# Altium schematic sheet Sheet1.SchDoc
size A
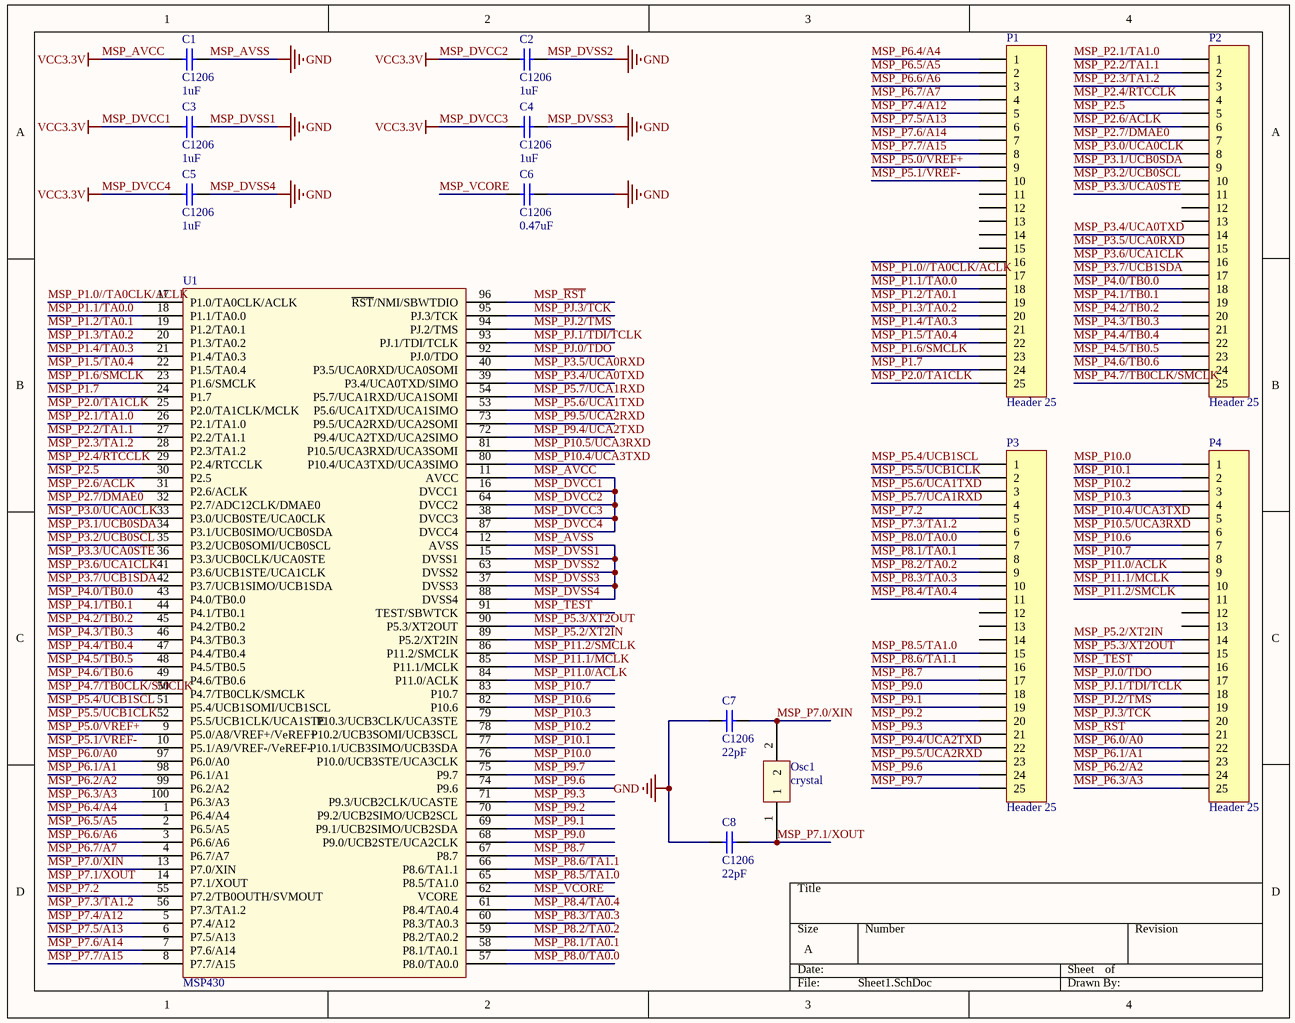
[diagram p0: Sheet1.SchDoc]

## Parts
C1  C1206  value 1uF  [1206]
C2  C1206  value 1uF  [1206]
C3  C1206  value 1uF  [1206]
C4  C1206  value 1uF  [1206]
C5  C1206  value 1uF  [1206]
C6  C1206  value 0.47uF  [1206]
C7  C1206  value 22pF  [1206]
C8  C1206  value 22pF  [1206]
Osc1  crystal  [PCBComponent_1]
P1  Header 25  [HDR1X25]
P2  Header 25  [HDR1X25]
P3  Header 25  [HDR1X25]
P4  Header 25  [HDR1X25]
U1  MSP430  [TSQFP50P1600X1600X160-100N]

## Nets
MSP_AVCC: C1.1 C2.1 C3.1 C4.1 C5.1 U1.11(AVCC) U1.16(DVCC1) U1.38(DVCC3) U1.64(DVCC2) U1.87(DVCC4)  [also labelled MSP_DVCC1, MSP_DVCC2, MSP_DVCC3, MSP_DVCC4, VCC3.3V]
MSP_AVSS: C1.2 C2.2 C3.2 C4.2 C5.2 C6.2 C7.1 C8.1 U1.12(AVSS) U1.15(DVSS1) U1.37(DVSS3) U1.63(DVSS2) U1.88(DVSS4)  [also labelled GND, MSP_DVSS1, MSP_DVSS2, MSP_DVSS3, MSP_DVSS4]
MSP_P1.0//TA0CLK/ACLK: P1.17 U1.17(P1.0/TA0CLK/ACLK)
MSP_P1.1/TA0.0: P1.18 U1.18(P1.1/TA0.0)
MSP_P1.2/TA0.1: P1.19 U1.19(P1.2/TA0.1)
MSP_P1.3/TA0.2: P1.20 U1.20(P1.3/TA0.2)
MSP_P1.4/TA0.3: P1.21 U1.21(P1.4/TA0.3)
MSP_P1.5/TA0.4: P1.22 U1.22(P1.5/TA0.4)
MSP_P1.6/SMCLK: P1.23 U1.23(P1.6/SMCLK)
MSP_P1.7: P1.24 U1.24(P1.7)
MSP_P2.0/TA1CLK: P1.25 U1.25(P2.0/TA1CLK/MCLK)
MSP_P2.1/TA1.0: P2.1 U1.26(P2.1/TA1.0)
MSP_P2.2/TA1.1: P2.2 U1.27(P2.2/TA1.1)
MSP_P2.3/TA1.2: P2.3 U1.28(P2.3/TA1.2)
MSP_P2.4/RTCCLK: P2.4 U1.29(P2.4/RTCCLK)
MSP_P2.5: P2.5 U1.30(P2.5)
MSP_P2.6/ACLK: P2.6 U1.31(P2.6/ACLK)
MSP_P2.7/DMAE0: P2.7 U1.32(P2.7/ADC12CLK/DMAE0)
MSP_P3.0/UCA0CLK: P2.8 U1.33(P3.0/UCB0STE/UCA0CLK)
MSP_P3.1/UCB0SDA: P2.9 U1.34(P3.1/UCB0SIMO/UCB0SDA)
MSP_P3.2/UCB0SCL: P2.10 U1.35(P3.2/UCB0SOMI/UCB0SCL)
MSP_P3.3/UCA0STE: P2.11 U1.36(P3.3/UCB0CLK/UCA0STE)
MSP_P3.4/UCA0TXD: P2.14 U1.39(P3.4/UCA0TXD/SIMO)
MSP_P3.5/UCA0RXD: P2.15 U1.40(P3.5/UCA0RXD/UCA0SOMI)
MSP_P3.6/UCA1CLK: P2.16 U1.41(P3.6/UCB1STE/UCA1CLK)
MSP_P3.7/UCB1SDA: P2.17 U1.42(P3.7/UCB1SIMO/UCB1SDA)
MSP_P4.0/TB0.0: P2.18 U1.43(P4.0/TB0.0)
MSP_P4.1/TB0.1: P2.19 U1.44(P4.1/TB0.1)
MSP_P4.2/TB0.2: P2.20 U1.45(P4.2/TB0.2)
MSP_P4.3/TB0.3: P2.21 U1.46(P4.3/TB0.3)
MSP_P4.4/TB0.4: P2.22 U1.47(P4.4/TB0.4)
MSP_P4.5/TB0.5: P2.23 U1.48(P4.5/TB0.5)
MSP_P4.6/TB0.6: P2.24 U1.49(P4.6/TB0.6)
MSP_P4.7/TB0CLK/SMCLK: P2.25 U1.50(P4.7/TB0CLK/SMCLK)
MSP_P5.0/VREF+: P1.9 U1.9(P5.0/A8/VREF+/VeREF+)
MSP_P5.1/VREF-: P1.10 U1.10(P5.1/A9/VREF-/VeREF-)
MSP_P5.2/XT2IN: P4.14 U1.89(P5.2/XT2IN)
MSP_P5.3/XT2OUT: P4.15 U1.90(P5.3/XT2OUT)
MSP_P5.4/UCB1SCL: P3.1 U1.51(P5.4/UCB1SOMI/UCB1SCL)
MSP_P5.5/UCB1CLK: P3.2 U1.52(P5.5/UCB1CLK/UCA1STE)
MSP_P5.6/UCA1TXD: P3.3 U1.53(P5.6/UCA1TXD/UCA1SIMO)
MSP_P5.7/UCA1RXD: P3.4 U1.54(P5.7/UCA1RXD/UCA1SOMI)
MSP_P6.0/A0: P4.22 U1.97(P6.0/A0)
MSP_P6.1/A1: P4.23 U1.98(P6.1/A1)
MSP_P6.2/A2: P4.24 U1.99(P6.2/A2)
MSP_P6.3/A3: P4.25 U1.100(P6.3/A3)
MSP_P6.4/A4: P1.1 U1.1(P6.4/A4)
MSP_P6.5/A5: P1.2 U1.2(P6.5/A5)
MSP_P6.6/A6: P1.3 U1.3(P6.6/A6)
MSP_P6.7/A7: P1.4 U1.4(P6.7/A7)
MSP_P7.0/XIN: C7.2 Osc1.2 U1.13(P7.0/XIN)
MSP_P7.1/XOUT: C8.2 Osc1.1 U1.14(P7.1/XOUT)
MSP_P7.2: P3.5 U1.55(P7.2/TB0OUTH/SVMOUT)
MSP_P7.3/TA1.2: P3.6 U1.56(P7.3/TA1.2)
MSP_P7.4/A12: P1.5 U1.5(P7.4/A12)
MSP_P7.5/A13: P1.6 U1.6(P7.5/A13)
MSP_P7.6/A14: P1.7 U1.7(P7.6/A14)
MSP_P7.7/A15: P1.8 U1.8(P7.7/A15)
MSP_P8.0/TA0.0: P3.7 U1.57(P8.0/TA0.0)
MSP_P8.1/TA0.1: P3.8 U1.58(P8.1/TA0.1)
MSP_P8.2/TA0.2: P3.9 U1.59(P8.2/TA0.2)
MSP_P8.3/TA0.3: P3.10 U1.60(P8.3/TA0.3)
MSP_P8.4/TA0.4: P3.11 U1.61(P8.4/TA0.4)
MSP_P8.5/TA1.0: P3.15 U1.65(P8.5/TA1.0)
MSP_P8.6/TA1.1: P3.16 U1.66(P8.6/TA1.1)
MSP_P8.7: P3.17 U1.67(P8.7)
MSP_P9.0: P3.18 U1.68(P9.0/UCB2STE/UCA2CLK)
MSP_P9.1: P3.19 U1.69(P9.1/UCB2SIMO/UCB2SDA)
MSP_P9.2: P3.20 U1.70(P9.2/UCB2SIMO/UCB2SCL)
MSP_P9.3: P3.21 U1.71(P9.3/UCB2CLK/UCASTE)
MSP_P9.4/UCA2TXD: P3.22 U1.72(P9.4/UCA2TXD/UCA2SIMO)
MSP_P9.5/UCA2RXD: P3.23 U1.73(P9.5/UCA2RXD/UCA2SOMI)
MSP_P9.6: P3.24 U1.74(P9.6)
MSP_P9.7: P3.25 U1.75(P9.7)
MSP_P10.0: P4.1 U1.76(P10.0/UCB3STE/UCA3CLK)
MSP_P10.1: P4.2 U1.77(P10.1/UCB3SIMO/UCB3SDA)
MSP_P10.2: P4.3 U1.78(P10.2/UCB3SOMI/UCB3SCL)
MSP_P10.3: P4.4 U1.79(P10.3/UCB3CLK/UCA3STE)
MSP_P10.4/UCA3TXD: P4.5 U1.80(P10.4/UCA3TXD/UCA3SIMO)
MSP_P10.5/UCA3RXD: P4.6 U1.81(P10.5/UCA3RXD/UCA3SOMI)
MSP_P10.6: P4.7 U1.82(P10.6)
MSP_P10.7: P4.8 U1.83(P10.7)
MSP_P11.0/ACLK: P4.9 U1.84(P11.0/ACLK)
MSP_P11.1/MCLK: P4.10 U1.85(P11.1/MCLK)
MSP_P11.2/SMCLK: P4.11 U1.86(P11.2/SMCLK)
MSP_PJ.0/TDO: P4.17 U1.92(PJ.0/TDO)
MSP_PJ.1/TDI/TCLK: P4.18 U1.93(PJ.1/TDI/TCLK)
MSP_PJ.2/TMS: P4.19 U1.94(PJ.2/TMS)
MSP_PJ.3/TCK: P4.20 U1.95(PJ.3/TCK)
MSP_~{RST}: P4.21 U1.96(~{RST}/NMI/SBWTDIO)
MSP_TEST: P4.16 U1.91(TEST/SBWTCK)
MSP_VCORE: C6.1 U1.62(VCORE)

Not connected (* = marked no-connect by the designer): P1 11 12 13 14 15 16; P2 12 13; P3 12 13 14; P4 12 13

## Library data of the parts
C1-C8 = C1206: Ceramic Chip Capacitor - Standard; Published: 17-Jul-2002; LatestRevisionDate: 19-Mar-2004; LatestRevisionNote: Silkscreen size reduced.; DatasheetDocument: Mar-2001; PackageDocument: Mar-2001; PackageReference: 1206; Publisher: Altium Limited; Code_JEITA: 1206; Code_IPC: 3216 [1206]; ComponentLink1Description: Manufacturer Link; ComponentLink1URL: http://www.kemet.com/; ComponentLink2Description: Datasheet; ComponentLink2URL: http://www.kemet.com/kemet/web/homepage/kechome.nsf/vapubfilesname/F3102TA.pdf/$file/F3102TA.pdf
P1-P4 = Header 25: Header, 25-Pin; LatestRevisionDate: 17-Jul-2002; LatestRevisionNote: Re-released for DXP Platform.; Publisher: Altium Limited